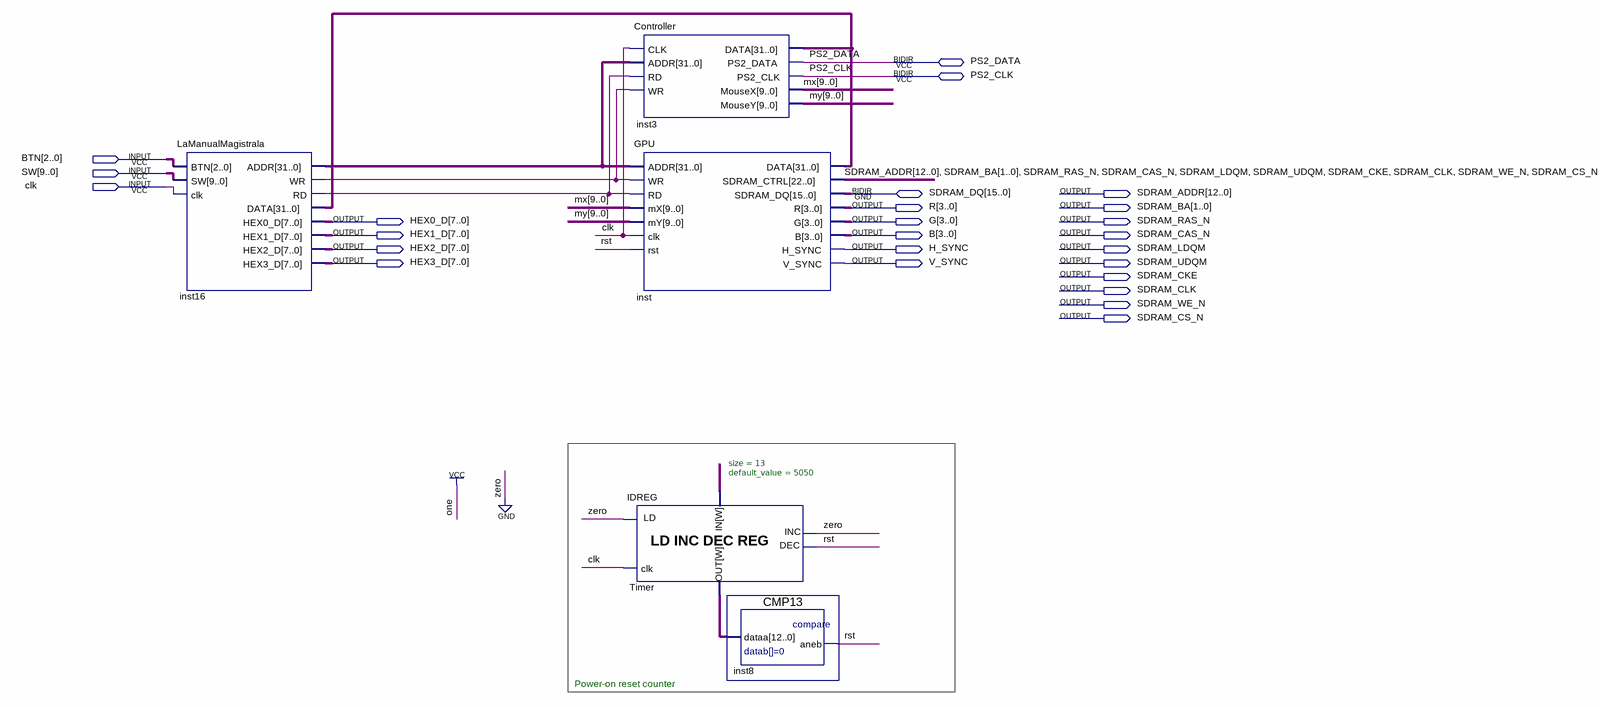
[diagram p0: schematic sheet]
// Quartus schematic GPUTest2.bdf as structural Verilog: 5 symbols, 25 pins
module GPUTest2 (
  input  [2:0] BTN,
  input  [9:0] SW,
  input  clk,
  inout  PS2_DATA,
  inout  PS2_CLK,
  inout  [15:0] SDRAM_DQ,
  output [12:0] SDRAM_ADDR,
  output [3:0] R,
  output [1:0] SDRAM_BA,
  output [7:0] HEX0_D,
  output [3:0] G,
  output SDRAM_RAS_N,
  output [7:0] HEX1_D,
  output [3:0] B,
  output SDRAM_CAS_N,
  output [7:0] HEX2_D,
  output H_SYNC,
  output SDRAM_LDQM,
  output [7:0] HEX3_D,
  output V_SYNC,
  output SDRAM_UDQM,
  output SDRAM_CKE,
  output SDRAM_CLK,
  output SDRAM_WE_N,
  output SDRAM_CS_N
);

  wire inst16_rd, inst16_wr, rst;
  wire [9:0] mx, my;
  wire [12:0] Timer_data_out;
  wire [31:0] inst16_addr, inst16_data;

  LaManualMagistrala inst16 (
    .BTN(BTN), .SW(SW), .clk(clk), .ADDR(inst16_addr), .WR(inst16_wr), .RD(inst16_rd), .HEX0_D(HEX0_D),
    .HEX1_D(HEX1_D), .HEX2_D(HEX2_D), .HEX3_D(HEX3_D), .DATA(inst16_data));
  Controller inst3 (
    .CLK(clk), .ADDR(inst16_addr), .RD(inst16_rd), .WR(inst16_wr), .MouseX(mx), .MouseY(my),
    .DATA(inst16_data), .PS2_DATA(PS2_DATA), .PS2_CLK(PS2_CLK));
  GPU inst (
    .ADDR(inst16_addr), .WR(inst16_wr), .RD(inst16_rd), .mX(mx), .mY(my), .clk(clk), .rst(rst),
    .SDRAM_CTRL({SDRAM_ADDR, SDRAM_BA, SDRAM_RAS_N, SDRAM_CAS_N, SDRAM_LDQM, SDRAM_UDQM, SDRAM_CKE, SDRAM_CLK, SDRAM_WE_N, SDRAM_CS_N}),
    .R(R), .G(G), .B(B), .H_SYNC(H_SYNC), .V_SYNC(V_SYNC), .DATA(inst16_data), .SDRAM_DQ(SDRAM_DQ));
  IDREG #(.size(13), .default_value(5050)) Timer (
    .clk(clk), .data_in({13{1'b0}}), .inc(1'b0), .dec(rst), .ld(1'b0), .data_out(Timer_data_out));
  CMP13 inst8 (.dataa(Timer_data_out), .aneb(rst));

  // Notes on the sheet:
  //   Power-on reset counter
endmodule
